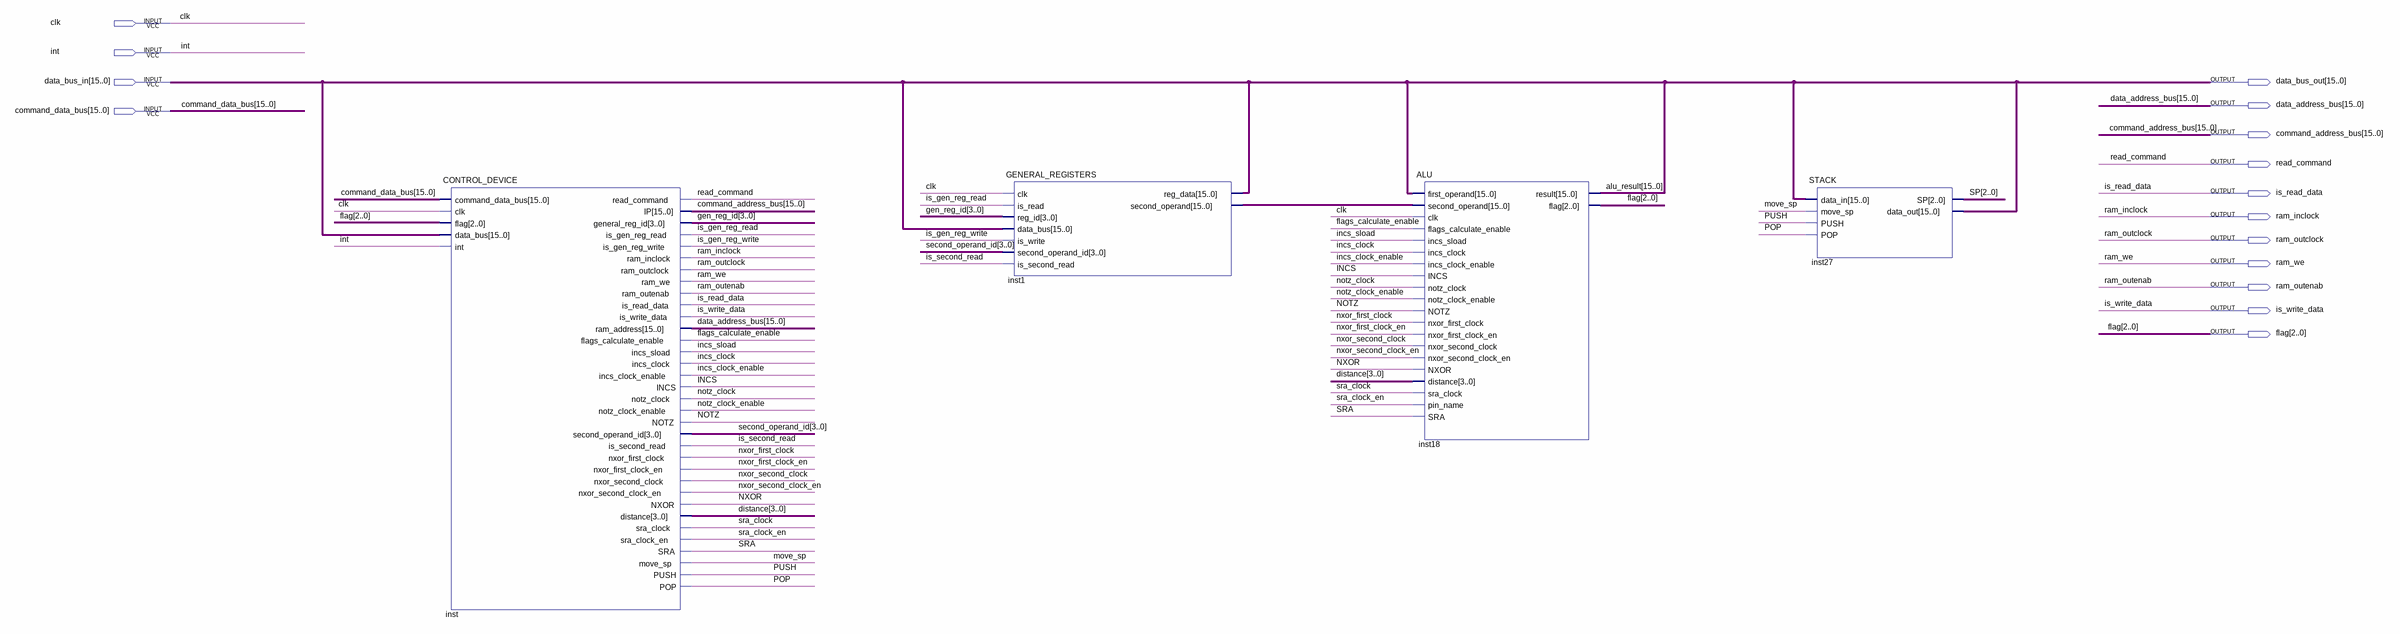
[diagram p0: schematic sheet]
// Quartus schematic CPU.bdf as structural Verilog: 4 symbols, 15 pins
module CPU (
  input  clk,
  input  \int ,
  input  [15:0] data_bus_in,
  input  [15:0] command_data_bus,
  output [15:0] data_bus_out,
  output [15:0] data_address_bus,
  output [15:0] command_address_bus,
  output read_command,
  output is_read_data,
  output ram_inclock,
  output ram_outclock,
  output ram_we,
  output ram_outenab,
  output is_write_data,
  output [2:0] flag
);

  wire flags_calculate_enable, INCS, incs_clock, incs_clock_enable, incs_sload, is_gen_reg_read,
       is_gen_reg_write, is_second_read, move_sp, NOTZ, notz_clock, notz_clock_enable, NXOR,
       nxor_first_clock, nxor_first_clock_en, nxor_second_clock, nxor_second_clock_en, POP, PUSH, SRA,
       sra_clock, sra_clock_en;
  wire [2:0] SP;
  wire [3:0] distance, gen_reg_id, second_operand_id;
  wire [15:0] inst1_second_operand;

  CONTROL_DEVICE inst (
    .command_data_bus(command_data_bus), .clk(clk), .flag(flag), .data_bus(data_bus_in), .\int (\int ),
    .read_command(read_command), .IP(command_address_bus), .general_reg_id(gen_reg_id),
    .is_gen_reg_read(is_gen_reg_read), .is_gen_reg_write(is_gen_reg_write), .ram_inclock(ram_inclock),
    .ram_outclock(ram_outclock), .ram_we(ram_we), .ram_outenab(ram_outenab), .is_read_data(is_read_data),
    .is_write_data(is_write_data), .ram_address(data_address_bus),
    .flags_calculate_enable(flags_calculate_enable), .incs_sload(incs_sload), .incs_clock(incs_clock),
    .incs_clock_enable(incs_clock_enable), .INCS(INCS), .notz_clock(notz_clock),
    .notz_clock_enable(notz_clock_enable), .NOTZ(NOTZ), .second_operand_id(second_operand_id),
    .is_second_read(is_second_read), .nxor_first_clock(nxor_first_clock),
    .nxor_first_clock_en(nxor_first_clock_en), .nxor_second_clock(nxor_second_clock),
    .nxor_second_clock_en(nxor_second_clock_en), .NXOR(NXOR), .distance(distance), .sra_clock(sra_clock),
    .sra_clock_en(sra_clock_en), .SRA(SRA), .move_sp(move_sp), .PUSH(PUSH), .POP(POP));
  GENERAL_REGISTERS inst1 (
    .clk(clk), .is_read(is_gen_reg_read), .reg_id(gen_reg_id), .data_bus(data_bus_in),
    .is_write(is_gen_reg_write), .second_operand_id(second_operand_id), .is_second_read(is_second_read),
    .reg_data(data_bus_in), .second_operand(inst1_second_operand));
  ALU inst18 (
    .first_operand(data_bus_in), .second_operand(inst1_second_operand), .clk(clk),
    .flags_calculate_enable(flags_calculate_enable), .incs_sload(incs_sload), .incs_clock(incs_clock),
    .incs_clock_enable(incs_clock_enable), .INCS(INCS), .notz_clock(notz_clock),
    .notz_clock_enable(notz_clock_enable), .NOTZ(NOTZ), .nxor_first_clock(nxor_first_clock),
    .nxor_first_clock_en(nxor_first_clock_en), .nxor_second_clock(nxor_second_clock),
    .nxor_second_clock_en(nxor_second_clock_en), .NXOR(NXOR), .distance(distance), .sra_clock(sra_clock),
    .pin_name(sra_clock_en), .SRA(SRA), .result(data_bus_in), .flag(flag));
  STACK inst27 (.data_in(data_bus_in), .move_sp(move_sp), .PUSH(PUSH), .POP(POP), .SP(SP), .data_out(data_bus_in));

  assign data_bus_out = data_bus_in;

  // Other names for the same wires on the sheet: alu_result[15:0] = data_bus_in
endmodule
